# Altium schematic sheet Sheet2.SchDoc
size A; SheetNumber: 1; SheetTotal: 1
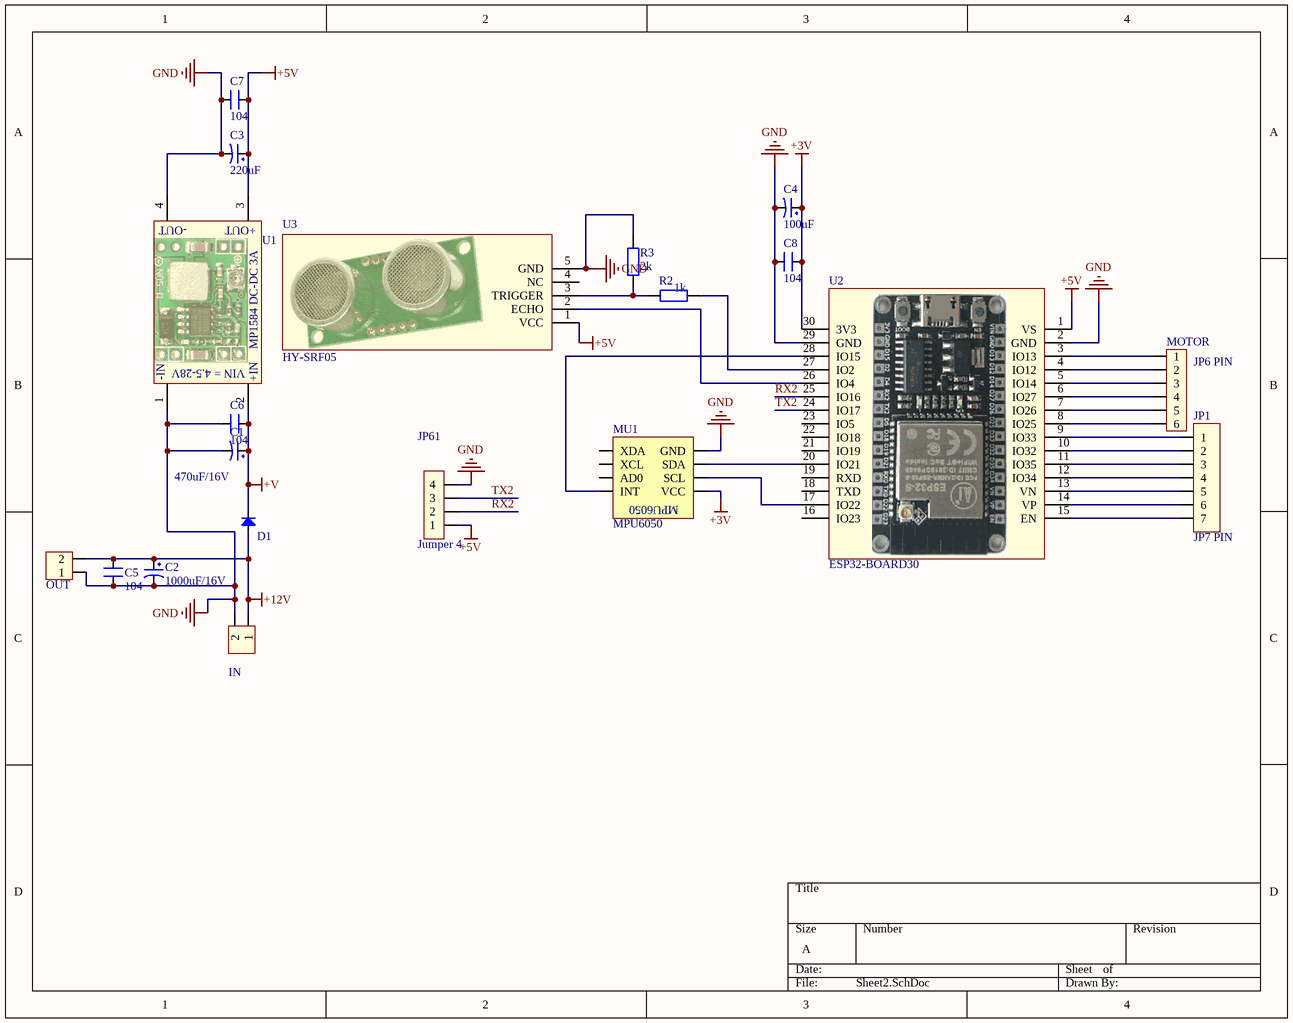
[diagram p0: Sheet2.SchDoc]

## Parts
C1  470uF/16V  [CP1.5/3.4]
C2  1000uF/16V  [CP1.5/3.4]
C3  220uF  [CP1/2.5]
C4  100uF  [CP1/2]
C5  104  [CN1.5]
C6  104  [CN1.5]
C7  104  [CN1.5]
C8  104  [CN2]
D1  Diode  [D1A]  (value not drawn)
IN  Header 2  [KF301-2P]  (value not drawn)
JP1  JP7 PIN  [JP7]
JP61  Jumper 4  [JP4]
MOTOR  JP6 PIN  [CON6]
MU1  MPU6050  [MPU6050]
OUT  Header 2  [KF301-2P]  (value not drawn)
R2  1k  [R1/4W]
R3  2k  [R1/4W]
U1  Module MP1584 DC-DC  [MP1584 DC-DC]  (value not drawn)
U2  ESP32-BOARD30  [ESP32-BOARD30-900]
U3  HY-SRF05  [SRF05]

## Nets
+3V: C4.1 C8.1 MU1.1(VCC) U2.30(3V3)
+5V: C3.1 C7.1 JP61.1 U1.3(+OUT) U2.1(VS) U3.1(VCC)
+12V: C2.1 C5.1 D1.1(A) IN.1 OUT.2
+V: C1.1 C6.1 D1.2(K) U1.2(+IN)
GND: C1.2 C2.2 C3.2 C4.2 C5.2 C6.2 C7.2 C8.2 IN.2 JP61.4 MU1.2(GND) OUT.1 R3.2 U1.1(-IN) U1.4(+OUT) U2.2(GND) U2.29(GND) U3.5(GND)
RX2: JP61.2 U2.25(IO16)
TX2: JP61.3 U2.24(IO17)
NetJP1_1: JP1.1 U2.9(IO33)
NetJP1_2: JP1.2 U2.10(IO32)
NetJP1_3: JP1.3 U2.11(IO35)
NetJP1_4: JP1.4 U2.12(IO34)
NetJP1_5: JP1.5 U2.13(VN)
NetJP1_6: JP1.6 U2.14(VP)
NetJP1_7: JP1.7 U2.15(EN)
NetMOTOR_1: MOTOR.1 U2.3(IO13)
NetMOTOR_2: MOTOR.2 U2.4(IO12)
NetMOTOR_3: MOTOR.3 U2.5(IO14)
NetMOTOR_4: MOTOR.4 U2.6(IO27)
NetMOTOR_5: MOTOR.5 U2.7(IO26)
NetMOTOR_6: MOTOR.6 U2.8(IO25)
NetMU1_3: MU1.3(SCL) U2.17(IO22)
NetMU1_4: MU1.4(SDA) U2.20(IO21)
NetMU1_8: MU1.8(INT) U2.28(IO15)
NetR2_1: R2.1 U2.27(IO2)
NetR2_2: R2.2 R3.1 U3.3(TRIGGER)
NetU2_26: U2.26(IO4) U3.2(ECHO)

Not connected (* = marked no-connect by the designer): MU1 5(XDA) 6(XCL) 7(AD0); U2 16(IO23) 18(TXD) 19(RXD) 21(IO19) 22(IO18) 23(IO5); U3 4(NC)

## Notes on the sheet
- (in symbol MP1584 DC-DC) -OUT; MP1584 DC-DC 3A; VIN = 4.5-28V

## Library data of the parts
C1 = CP3: Cap 100uF/35V - 470uF/16V; Value: 100uF/35V/50V; Description 1: 1000uF/6,3V - 470uF/16V - 330uF - 25V; Description 2: 220uF/35V - 100uF/50V - 63V - 4,7uF/200V; Description 3: 22uF => 33uF100V - 3,3uF => 4,7uF/250V; Description 4: 2,2uF =>3,3uF/350 - 2,2uF/400V - 1uF/450V
C2 = CP4: Cap 1000uF/16V - 220uF/50V; Description 5: 4,7uF>10uF/250V_3,3uF>10uF/400V - 2,2uF>4,7uF/450V; Description 1: 2200uF-3300uF/6,3V - 1000uF-2200uF/10V; Description 2: 1000uF/16V - 470uF => 1000uF/25V - 100uF/100V; Description 3: 330uF>470uF/35V_220uF>470uF/50V_10uF>22uF/250V; Description 4: 220uF => 330uF/63V - 10uF =>33uF/160 - 200V; Value: 1000uF/16V
C3 = CP2: C 47uF/50V , 220uF/16V; Value: 47uF/16 - 50V; Description 1: 470uF/6,3V - 330uF/10V - 220uF/16V; Description 2: 100uF/25V - 35V - 47uF/50V - 22uF/100V; Description 3: 33uF => 47uF/63V - 1uF => 4,7uF/160V; Description 4: 1uF => 2,2uF/250V - 1uF/350V
C4 = CP1: Cap P  0,1uF < 22uF , 16 - 50V; Value: 10uF/50V; Description 1: 10 => 220uF/6,3V/10V - 10uF => 100uF/16V; Description 2: 0,1uF => 33uF/50V - 10uF => 22uF/63V; Description 3: 0,47uF => 10uF/100V
C5-C8 = CN2: Cap np 104 => 105pF; Value: 0.1uF
D1 = Diode: Default Diode; Code - JEDEC: DO-214-AB; Value: 1N5007; Published: 8-Jun-2000; Revision: July-2002: Re-released for DXP Platform.; Publisher: Altium Limited
IN OUT = Hed2: Header 2 (Green); Value: Header 2
JP1 = JP7: Value: JP7
JP61 = JP4: Value: J3
MOTOR = ISP6: ISP6 PIN; Value: JP7
MU1 = MPU6050: Manufacturer: W¨¹rth Elektronik eiSos GmbH; partNo: 613004143121; ComponentLink1 Description: Manufacturer; ComponentLink2 Description: Datasheet; NoPins: 04; Created Date: 29 March 2013; ComponentLink1URL: http://www.we-online.com; ComponentLink2URL: http://katalog.we-online.de/em/datasheet/6130xx143121.pdf; Created by: Karrer Zheng
R2 R3 = R1/4W: Resistor 1/4W; Value: R1/4W - 1K
U1 = MP1584 DC-DC